# Altium schematic sheet I2C_Display.SchDoc
size A4; DocumentNumber: 12; SheetNumber: 12; SheetTotal: 16
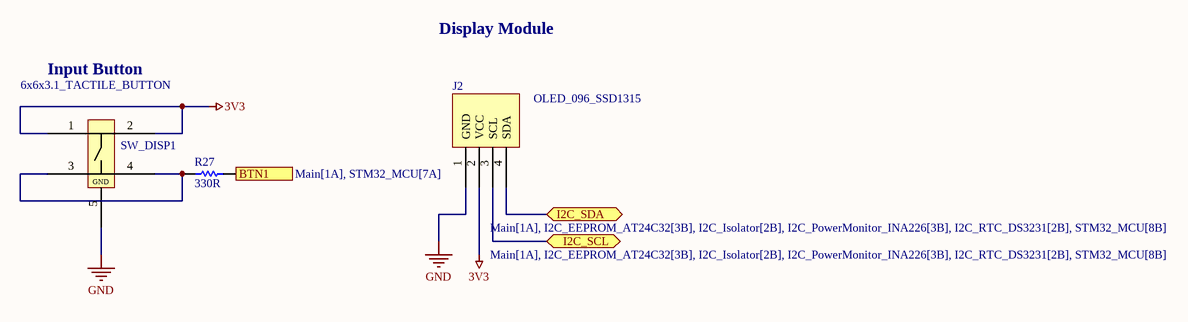
[diagram p0: I2C_Display.SchDoc]

## Parts
J2  OLED_096_SSD1315  [OLED_096_SSD1315]
R27  330R  [RESC1608X55X30LL15T15]
SW_DISP1  6x6x3.1_TACTILE_BUTTON  [6x6x3.1_TACTILE_BUTTON]

## Ports
BTN1 (in, see Main[1A], STM32_MCU[7A]), I2C_SCL (bidir, see Main[1A], I2C_EEPROM_AT24C32[3B], I2C_Isolator[2B], I2C_PowerMonitor_INA226[3B], I2C_RTC_DS3231[2B], STM32_MCU[8B]), I2C_SDA (bidir, see Main[1A], I2C_EEPROM_AT24C32[3B], I2C_Isolator[2B], I2C_PowerMonitor_INA226[3B], I2C_RTC_DS3231[2B], STM32_MCU[8B])

## Nets
3V3: J2.2(VCC) SW_DISP1.1 SW_DISP1.2
GND: J2.1(GND) SW_DISP1.5
BTN1: R27.2 ; port BTN1
I2C_SCL: J2.3(SCL) ; port I2C_SCL
I2C_SDA: J2.4(SDA) ; port I2C_SDA
NetR27_1: R27.1 SW_DISP1.3 SW_DISP1.4

## Notes on the sheet
- Input Button
- Display Module
- (in symbol 6x6x3.1_TACTILE_BUTTON) GND

## Library data of the parts
R27 = CMP-2000-00435-2: Chip Resistor, 330 Ohm, +/- 1%, 0.1 W, -55 to 155 degC, 0603 (1608 Metric), RoHS, Tape and Reel; Gender: Male; Mating Cycles: 10000; Current Rating: 500 mA; Voltage Rating: 10 V; REACH SVHC: No SVHC; PackageDescription: 2-Pin Surface Mount Device, Body 1.6 x 0.85 mm; Contact Finish: Gold; Pins: 8; ComponentLink1Description: Manufacturer URL; Packaging: Tape and Reel; Max Operating Temperature: 85 degC; Contact Material: Copper; Height: 1.45 mm; Width: 1.45 mm; DatasheetVersion: Apr-15; Package Quantity: 1500; Contact Plating: Gold; PackageReference: 0603; Mount: Surface Mount; Lead Pitch: 1.1 mm; Min Operating Temperature: -25 degC; ComponentLink1URL: http://www.panasonic.com/; ComponentLink2URL: http://industrial.panasonic.com/cdbs/www-data/pdf/RDA0000/AOA0000C86.pdf; Length: 13.7 mm; ComponentLink2Description: Datasheet; RoHSCompliant: true